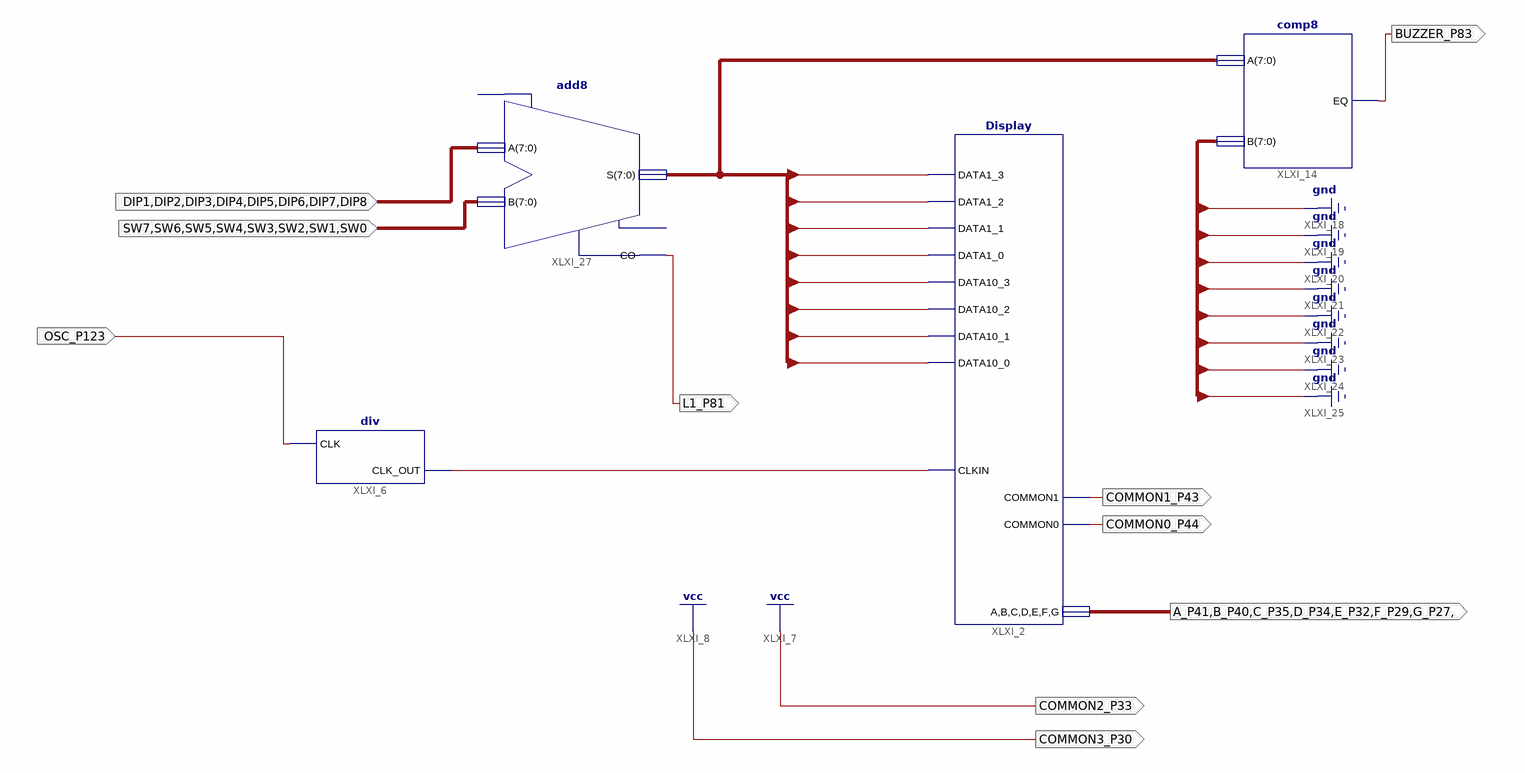
[diagram p0: schematic sheet 1]
// Xilinx ISE schematic Lab8.sch (spartan6) as structural Verilog: 4 symbols, 10 ports
module Lab8 (
  input  SW7,
  input  SW6,
  input  SW5,
  input  SW4,
  input  SW3,
  input  SW2,
  input  SW1,
  input  SW0,
  input  OSC_P123,
  input  DIP1,
  input  DIP2,
  input  DIP3,
  input  DIP4,
  input  DIP5,
  input  DIP6,
  input  DIP7,
  input  DIP8,
  output COMMON0_P44,
  output COMMON1_P43,
  output COMMON2_P33,
  output A_P41,
  output B_P40,
  output C_P35,
  output D_P34,
  output E_P32,
  output F_P29,
  output G_P27,
  output BUZZER_P83,
  output L1_P81,
  output COMMON3_P30
);

  wire XLXN_27;
  wire [7:0] Q;

  Display XLXI_2 (
    .CLKIN(XLXN_27), .DATA1_0(Q[0]), .DATA10_0(Q[4]), .DATA1_1(Q[1]), .DATA10_1(Q[5]), .DATA1_2(Q[2]),
    .DATA10_2(Q[6]), .DATA1_3(Q[3]), .DATA10_3(Q[7]), .COMMON1(COMMON1_P43), .COMMON0(COMMON0_P44),
    .A(A_P41), .B(B_P40), .C(C_P35), .D(D_P34), .E(E_P32), .F(F_P29), .G(G_P27));
  div XLXI_6 (.CLK(OSC_P123), .CLK_OUT(XLXN_27));
  comp8 XLXI_14 (.A(Q), .B({8{1'b0}}), .EQ(BUZZER_P83));
  add8 XLXI_27 (
    .A({DIP1, DIP2, DIP3, DIP4, DIP5, DIP6, DIP7, DIP8}), .B({SW7, SW6, SW5, SW4, SW3, SW2, SW1, SW0}),
    .CO(L1_P81), .S(Q));  // open: CI, OFL

  assign COMMON2_P33 = 1'b1;
  assign COMMON3_P30 = 1'b1;
endmodule
